# Altium schematic sheet iTag4Sensors2.SchDoc
size A
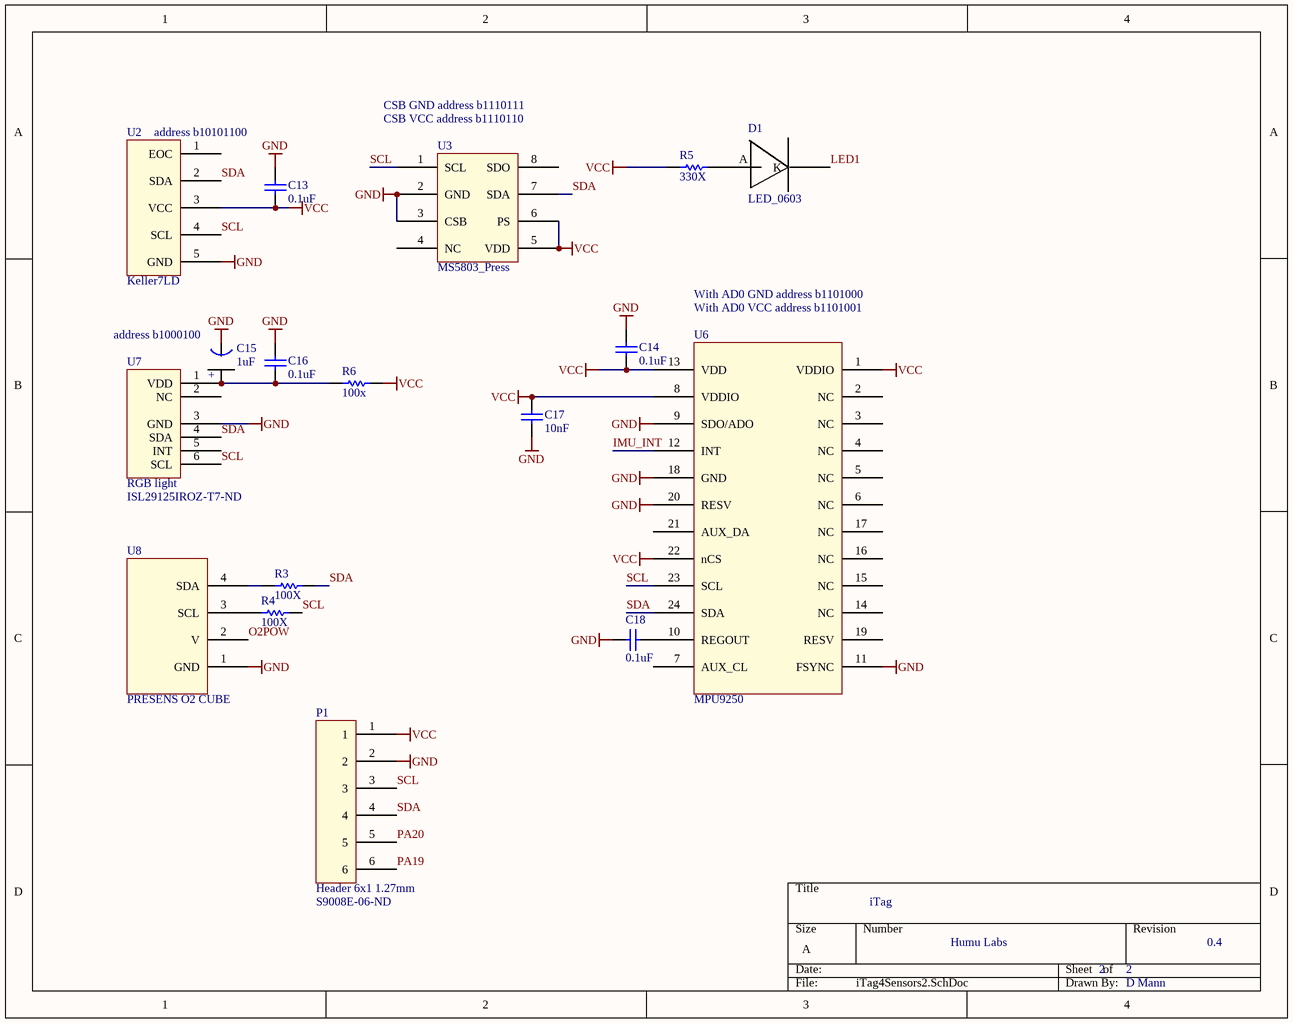
[diagram p0: iTag4Sensors2.SchDoc]

## Parts
C13  0.1uF  [0402]
C14  0.1uF  [0402]
C15  1uF  [Tant0805]
C16  0.1uF  [0402]
C17  10nF  [0402]
C18  0.1uF  [0402]
D1  LED_0603  [Diode0603]
P1  Header 6x1 1.27mm  Supplier Part Number 1: S9008E-06-ND  [Header6x1 1.27mm]
R3  100X  [3-0603]
R4  100X  [3-0603]
R5  330X  [3-0603]
R6  100x  [3-0603]
U2  Keller7LD  [Keller7LD]
U3  MS5803_Press  [MS5803_Press]
U6  MPU9250  [MPU6500]
U7  RGB light  Supplier Part Number 1: ISL29125IROZ-T7-ND  [ODFN]
U8  PRESENS O2 CUBE  [PRESENS_O2]

## Nets
GND: C13.2 C14.2 C15.1(GND) C16.2 C17.2 C18.1 P1.2 U2.5(GND) U3.2(GND) U3.3(CSB) U6.9(SDO/ADO) U6.11(FSYNC) U6.18(GND) U6.20(RESV) U7.3(GND) U8.1(GND)
VCC: C13.1 C14.1 C17.1 P1.1 R5.1 R6.1 U2.3(VCC) U3.5(VDD) U3.6(PS) U6.1(VDDIO) U6.8(VDDIO) U6.13(VDD) U6.22(nCS)
IMU_INT: U6.12(INT)
LED1: D1.K
O2POW: U8.2(V)
PA19: P1.6
PA20: P1.5
SCL: P1.3 R4.2 U2.4(SCL) U3.1(SCL) U6.23(SCL) U7.6(SCL)
SDA: P1.4 R3.2 U2.2(SDA) U3.7(SDA) U6.24(SDA) U7.4(SDA)
NetC15_2: C15.2(+) C16.1 R6.2 U7.1(VDD)
NetC18_2: C18.2 U6.10(REGOUT)
NetD1_A: D1.A R5.2
NetR3_1: R3.1 U8.4(SDA)
NetR4_1: R4.1 U8.3(SCL)

Not connected (* = marked no-connect by the designer): U2 1(EOC); U3 4(NC) 8(SDO); U6 2(NC) 3(NC) 4(NC) 5(NC) 6(NC) 7(AUX_CL) 14(NC) 15(NC) 16(NC) 17(NC) 19(RESV) 21(AUX_DA); U7 2(NC) 5(INT)

## Notes on the sheet
- (near U2) address b10101100
- CSB GND address b1110111
- (near U3) CSB VCC address b1110110
- With AD0 GND address b1101000
- (near C15) address b1000100
- With AD0 VCC address b1101001
- iTag
- Humu Labs
- 2
- 0.4
- D Mann

## Library data of the parts
C13 C14 C16-C18 = C0402: Ceramic Chip Capacitor - Standard; Note: Footprint corresponds to dimensions for bulk cassette packaging. This case size has tightened tolerances.; Published: 17-Jul-2002; LatestRevisionDate: 19-Mar-2004; LatestRevisionNote: Silkscreen size reduced.; DatasheetDocument: Mar-2001; PackageDocument: Mar-2001; PackageReference: 0402; Publisher: Altium Limited; Code_JEITA: 0402; Code_IPC: 1005 [0402]; ComponentLink1Description: Manufacturer Link; ComponentLink1URL: http://www.kemet.com/; ComponentLink2Description: Datasheet; ComponentLink2URL: http://www.kemet.com/kemet/web/homepage/kechome.nsf/vapubfilesname/F3102TA.pdf/$file/F3102TA.pdf
  C13 C14 C16 C18: Value: 0.1uF
  C17: Value: 10nF
C15 = Tant0805: Value: *
R3-R6 = ERJ3RK: Precision Thick Film Chip Resistor, 10 Ohm to 1M Ohm Range, 1% and 0.5% Tolerance, 0603 Size, 0.063 W; Published: 17-Dec-2003; LatestRevisionDate: 19-Mar-2004; LatestRevisionNote: Silkscreen size reduced.; PackageDocument: Mar-2003; PackageReference: 3-0603; Publisher: Altium Limited; Code_IPC: 1608 [0603]; ComponentLink1Description: Manufacturer Link; ComponentLink1URL: http://www.panasonic.com/industrial/components/resistive_products.htm; ComponentLink2Description: Datasheet; ComponentLink2URL: http://www.panasonic.com/industrial/components/pdf/AOA0000CE2.pdf
U2 = Keller 7LD: Keller Pressure/Temp; PDF: http://www.kelleramerica.com/pdf-library/Piezoresistive%20OEM%20Pressure%20Transmitters%20with%20I2C%20interface%20and%20embedded%20signal%20conditioning.pdf
U6 = MPU-9250: Invensense
U7 = ISL29125: RGB light sensor; Supplier 1: Digi-Key
U8 = PRESENS_O2
P1 = Header 6x1 1.27mm: Supplier 1: Digi-Key